# Altium schematic sheet esc.SchDoc
size A
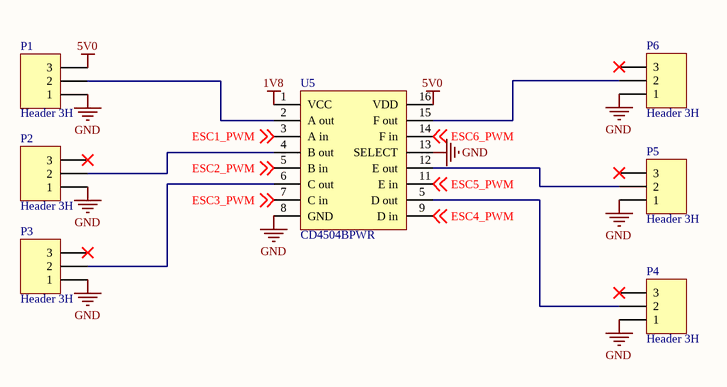
[diagram p0: esc.SchDoc]

## Parts
P1  Header 3H  [HDR1X3H]
P2  Header 3H  [HDR1X3H]
P3  Header 3H  [HDR1X3H]
P4  Header 3H  [HDR1X3H]
P5  Header 3H  [HDR1X3H]
P6  Header 3H  [HDR1X3H]
U5  CD4504BPWR  [CD4504BPWR_16TSSOP]

## Nets
1V8: U5.1(VCC)
5V0: P1.3 U5.16(VDD)
GND: P1.1 P2.1 P3.1 P4.1 P5.1 P6.1 U5.8(GND) U5.13(SELECT)
ESC1_PWM: U5.3(A_in) ; off-sheet ESC1_PWM
ESC2_PWM: U5.5(B_in) ; off-sheet ESC2_PWM
ESC3_PWM: U5.7(C_in) ; off-sheet ESC3_PWM
ESC4_PWM: U5.9(D_in) ; off-sheet ESC4_PWM
ESC5_PWM: U5.11(E_in) ; off-sheet ESC5_PWM
ESC6_PWM: U5.14(F_in) ; off-sheet ESC6_PWM
NetP1_2: P1.2 U5.2(A_out)
NetP2_2: P2.2 U5.4(B_out)
NetP3_2: P3.2 U5.6(C_out)
NetP4_2: P4.2 U5.5(D_out)
NetP5_2: P5.2 U5.12(E_out)
NetP6_2: P6.2 U5.15(F_out)

Not connected (* = marked no-connect by the designer): P2 3*; P3 3*; P4 3*; P5 3*; P6 3*

## Library data of the parts
P1-P6 = Header 3H: Header, 3-Pin, Right Angle; LatestRevisionDate: 17-Jul-2002; LatestRevisionNote: Re-released for DXP Platform.; Publisher: Altium Limited